# Altium project stm32_balancing.PrjPcb
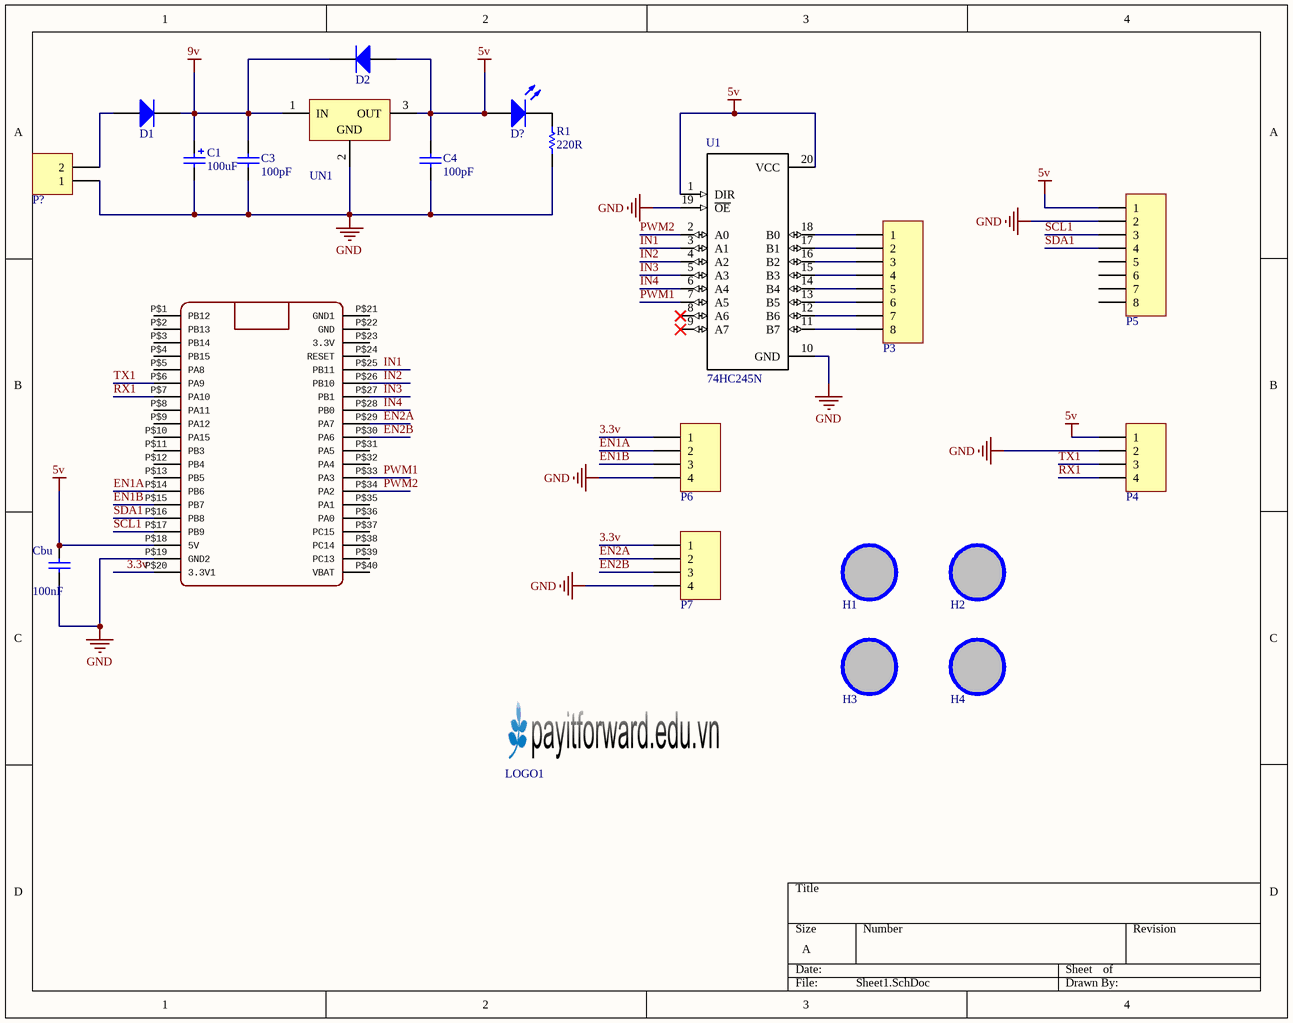
[diagram p0: Sheet1.SchDoc]
1 sheet, 22 parts. Net scope: global (net labels, ports and power ports of the same name join across sheets).
Board files: ATCBus.PcbDoc, PCB1.PcbDoc

## Sheet Sheet1.SchDoc
size A

### Parts
2  BLUE_PILL  [BLUE_PILL]  (value not drawn)
C1  value 100uF  [CP1/2.5]  (hidden comment: Cap Pol)
C3  value 100pF  [CAP-SM-0805]  (hidden comment: Cap Non-Pol SMD)
C4  value 100pF  [CAP-SM-0805]  (hidden comment: Cap Non-Pol SMD)
Cbu  value 100nF  [CAP-SM-0805]  (hidden comment: Cap Non-Pol SMD)
D1  Diode  [D1A]  (value not drawn)
D2  Diode  [D1A]  (value not drawn)
D?  LED  [LED-3mm]  (value not drawn)
H1  Hole  [LO KHOAN 3MM]  (value not drawn)
H2  Hole  [LO KHOAN 3MM]  (value not drawn)
H3  Hole  [LO KHOAN 3MM]  (value not drawn)
H4  Hole  [LO KHOAN 3MM]  (value not drawn)
LOGO1  LOGO PIF  [PIF LOGO BIG SSTOP]  (value not drawn)
P3  Header 8  [JP8]  (value not drawn)
P4  Header 4  [JP4]  (value not drawn)
P5  Header 8  [JP8]  (value not drawn)
P6  Header 4  [JP4]  (value not drawn)
P7  Header 4  [JP4]  (value not drawn)
P?  Domino 2  [DOMINO 2- 5mm]  (value not drawn)
R1  value 220R  [RES-SM-0805]  (hidden comment: RESISTOR SMD)
U1  74HC245N  [*DIP762W45P254L2692H420Q20]
UN1  LM7805  [QTO-220]  (value not drawn)

### Nets
5v: 2.P$18(5V) C4.2 Cbu.2 D2.1(A) D?.1(A) P4.1 P5.1 U1.1(DIR) U1.20(VCC) UN1.3(OUT)
9v: C1.1 C3.2 D1.2(K) D2.2(K) UN1.1(IN)
GND: 2.P$19(GND2) C1.2 C3.1 C4.1 Cbu.1 P4.2 P5.2 P6.4 P7.4 P?.1 R1.1 U1.10(GND) U1.19(~{OE}) UN1.2(GND)
3.3v: 2.P$20(3.3V1) P6.1 P7.1
EN1A: 2.P$14(PB6) P6.2
EN1B: 2.P$15(PB7) P6.3
EN2A: 2.P$29(PA7) P7.2
EN2B: 2.P$30(PA6) P7.3
IN1: 2.P$25(PB11) U1.3(A1)
IN2: 2.P$26(PB10) U1.4(A2)
IN3: 2.P$27(PB1) U1.5(A3)
IN4: 2.P$28(PB0) U1.6(A4)
PWM1: 2.P$33(PA3) U1.7(A5)
PWM2: 2.P$34(PA2) U1.2(A0)
RX1: 2.P$7(PA10) P4.4
SCL1: 2.P$17(PB9) P5.3
SDA1: 2.P$16(PB8) P5.4
TX1: 2.P$6(PA9) P4.3
NetD1_1: D1.1(A) P?.2
NetD?_2: D?.2(K) R1.2
NetP3_1: P3.1 U1.18(B0)
NetP3_2: P3.2 U1.17(B1)
NetP3_3: P3.3 U1.16(B2)
NetP3_4: P3.4 U1.15(B3)
NetP3_5: P3.5 U1.14(B4)
NetP3_6: P3.6 U1.13(B5)
NetP3_7: P3.7 U1.12(B6)
NetP3_8: P3.8 U1.11(B7)

Not connected (* = marked no-connect by the designer): 2 P$1(PB12) P$2(PB13) P$3(PB14) P$4(PB15) P$5(PA8) P$8(PA11) P$9(PA12) P$10(PA15) P$11(PB3) P$12(PB4) P$13(PB5) P$21(GND1) P$22(GND) P$23(3.3V) P$24(RESET) P$31(PA5) P$32(PA4) P$35(PA1) P$36(PA0) P$37(PC15) P$38(PC14) P$39(PC13) P$40(VBAT); H1 1; H2 1; H3 1; H4 1; P5 5 6 7 8; U1 8(A6)* 9(A7)*

### Library data of the parts
2 = BLUE_PILL: GateName_1: G$1; SymbolName_1: BLUE_PILL; LibraryName: BluePill; DeviceSetName: BLUE_PILL; Package: BLUE_PILL
C1 = Cap Pol: Polarized Capacitor (Radial)
C3 C4 Cbu = Cap Non-Pol SMD: Capacitor
D1 D2 = Diode: Default Diode
H1-H4 = Hole: Hole 3mm
P3 P5 = Header 8: Header, 8-Pin; LatestRevisionDate: 17-Jul-2002; LatestRevisionNote: Re-released for DXP Platform.; Publisher: Altium Limited
P4 P6 P7 = Header 4: Header, 4-Pin; LatestRevisionDate: 17-Jul-2002; LatestRevisionNote: Re-released for DXP Platform.; Publisher: Altium Limited
P? = Domino 2: Domino, 2-Pin; LatestRevisionDate: 17-Jul-2002; LatestRevisionNote: Re-released for DXP Platform.; Publisher: Altium Limited
R1 = RESISTOR SMD: Resistor
U1 = 74HC245N: 20pin Dip/Pkg Tri-State Octal Bus Transceiver; MF: NXP Semiconductors; Availability: Unavailable; Price: None; Package: DIP-20 NXP Semiconductors; SnapEDA_Link: https://www.snapeda.com/parts/74HC245N/NXP%20Semiconductors/view-part/?ref=snap; MP: 74HC245N; Value: *
UN1 = LM7805: Positive Voltage Regulator